# Altium project Adafruit Feather STM32F405 Express.PrjPcb
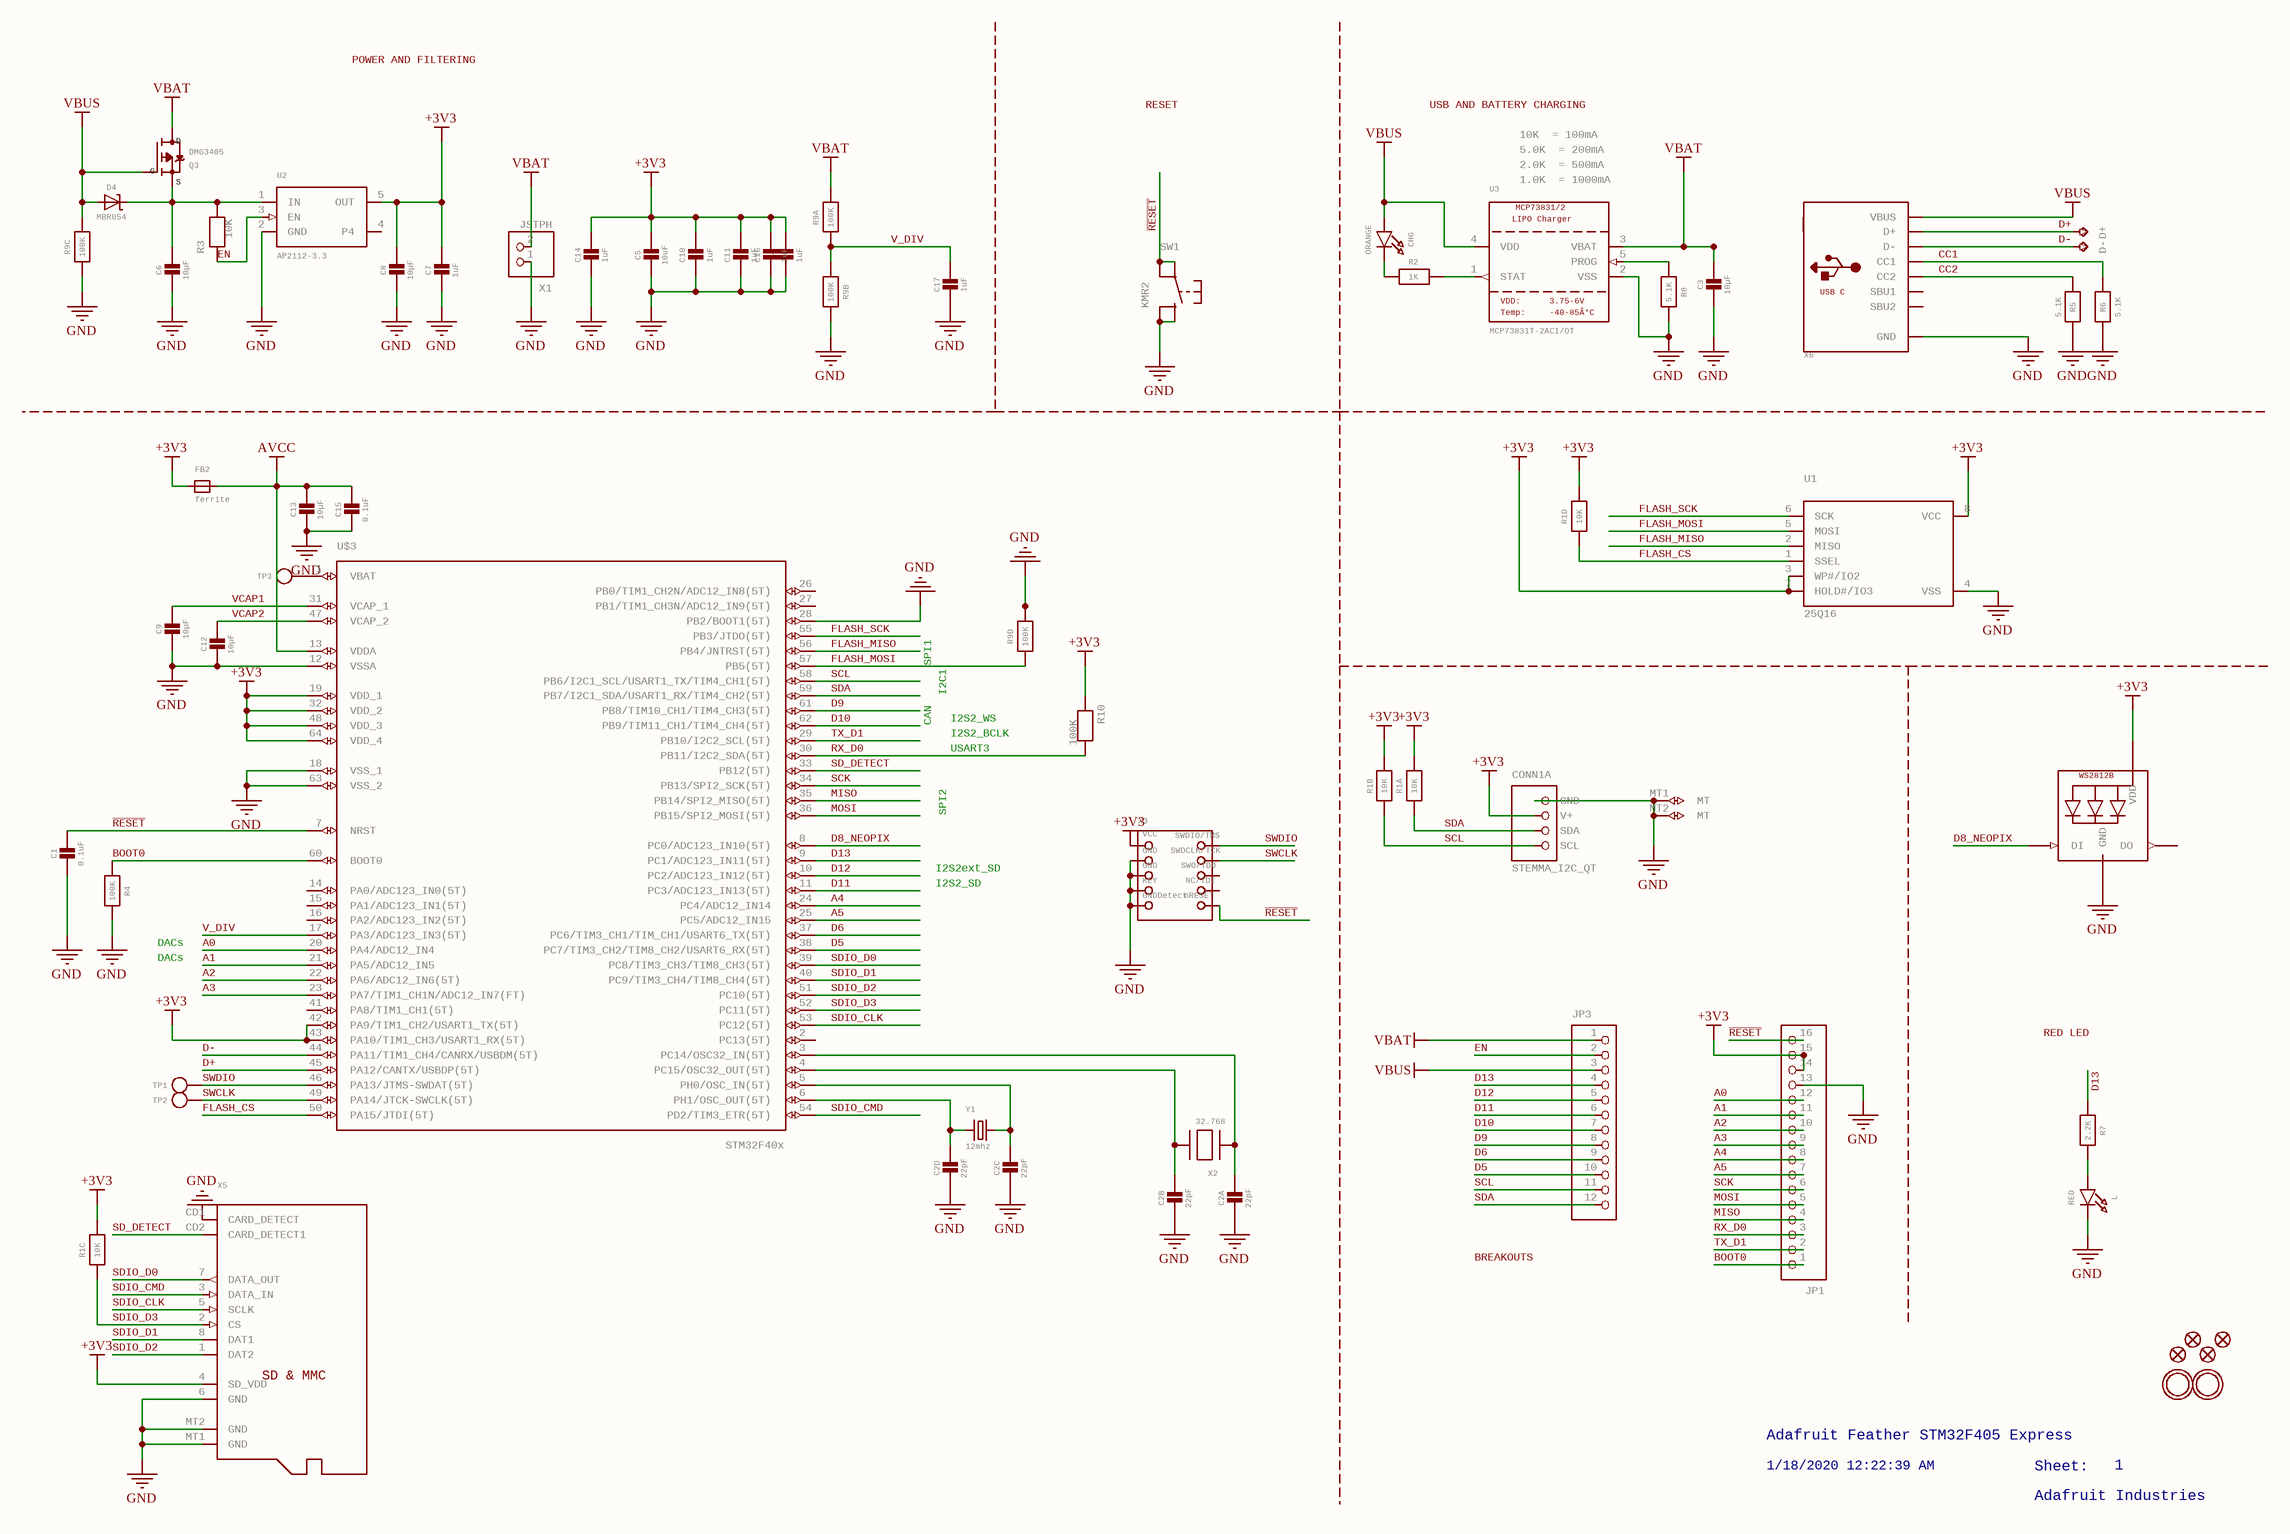
[diagram p0: Adafruit Feather STM32F405 Express.SchDoc]
1 sheet, 58 parts. Net scope: global (net labels, ports and power ports of the same name join across sheets).
Board file: Adafruit Feather STM32F405 Express.PcbDoc

## Sheet Adafruit Feather STM32F405 Express.SchDoc: Adafruit Feather STM32F405 Express
size 409 x 289 mm; COMPANY: ADAFRUIT INDUSTRIES; DRAWN: KTOWN; REV: B; Origin: Eagle; OriginPath: D:\DESK\T_Desk\3D Parts\PCBs\Dual-Node-Performance-Tracker\PCB\Adafruit Feather STM32F405 Express.sch; OriginSheet: 1; Date: 1/18/2020 12:22:39 AM; SheetNumber: 1; GateName_1: G$1; SymbolName_1: FRAME_A3_ADAFRUIT; LibraryName: microbuilder; DeviceSetName: FRAME_A3_ADAFRUIT; Sheet: Sheet:; AdafruitIndustries: Adafruit Industries

### Parts
C1  0.1uF  [0603-NO]
C2  22pF  [RESPACK_4X0603]  (parts A,B,C,D of 4)
C3  10µF  [0805-NO]
C4  1uF  [0603-NO]
C5  10uF  [0805-NO]
C6  10µF  [0805-NO]
C7  1uF  [0603-NO]
C8  10µF  [0805-NO]
C9  10µF  [0805-NO]
C10  1uF  [0603-NO]
C11  1uF  [0603-NO]
C12  10µF  [0805-NO]
C13  10µF  [0805-NO]
C14  1uF  [0603-NO]
C15  0.1uF  [0603-NO]
C16  1uF  [0603-NO]
C17  1uF  [0603-NO]
CHG  ORANGE  [CHIPLED_0805_NOOUTLINE]
CONN1  STEMMA_I2C_QT  [JST_SH4]  (parts A,B,C of 3)
D4  MBR054  [SOD-123]
D+  TPB1,27  [B1,27]  (value not drawn)
D-  TPB1,27  [B1,27]  (value not drawn)
FB2  ferrite  [0805-NO]
JP1  HEADER-1X16ROUND  [1X16_ROUND]  (value not drawn)
JP3  HEADER-1X12  [1X12_ROUND]  (value not drawn)
L  RED  [CHIPLED_0805_NOOUTLINE]
LED1  WS2812B3535  [LED3535]  (value not drawn)
Q3  DMG3405  [SOT23-R]
R1  10K  [RESPACK_4X0603_NO]  (parts A,B,C,D of 4)
R2  1K  [0603-NO]
R3  10K  [0603-NO]
R4  100K  [0603-NO]
R5  5.1K  [0603-NO]
R6  5.1K  [0603-NO]
R7  2.2K  [0603-NO]
R8  5.1K  [0603-NO]
R9  100K  [RESPACK_4X0603_NO]  (parts A,B,C,D of 4)
R10  100K  [0603-NO]
SW1  KMR2  [BTN_KMR2_4.6X2.8]
TP1  TESTPOINTROUND1.5MM  [TESTPOINT_ROUND_1.5MM]  (value not drawn)
TP2  TESTPOINTROUND1.5MM  [TESTPOINT_ROUND_1.5MM]  (value not drawn)
TP3  TESTPOINTROUND1.5MM  [TESTPOINT_ROUND_1.5MM]  (value not drawn)
U1  25Q16  [SOIC8_150MIL]
U2  AP2112-3.3  [SOT23-5]
U3  MCP73831T-2ACI/OT  LIPOCharger: LIPO Charger  Temp: Temp:  VDD: VDD:  [SOT23-5]
U$3  STM32F405R  [TQFP64]  (value not drawn)
U$5  FIDUCIAL_1MM  [FIDUCIAL_1MM]  (value not drawn)
U$31  MOUNTINGHOLE2.5  [MOUNTINGHOLE_2.5_PLATED]  (value not drawn)
U$32  MOUNTINGHOLE2.5  [MOUNTINGHOLE_2.5_PLATED]  (value not drawn)
U$34  FIDUCIAL_1MM  [FIDUCIAL_1MM]  (value not drawn)
U$35  FIDUCIAL_1MM  [FIDUCIAL_1MM]  (value not drawn)
U$37  FIDUCIAL_1MM  [FIDUCIAL_1MM]  (value not drawn)
X1  JSTPH  [JSTPH2]
X2  32.768  [XTAL3215]
X3  JTAG-CORTEX  [2X05_1.27MM_SMT]  (value not drawn)
X5  SD&MMC: SD & MMC  [MICROSD]  (hidden comment: MICROSD)
X6  USBC: USB C  [USB_C_CUSB31-CFM2AX-01-X]  (hidden comment: USB_C)
Y1  12mhz  [CRYSTAL_2.5X2]

### Nets
+3V3: C4.1 C5.1 C7.1 C8.1 C10.1 C11.1 C14.1 C16.1 CONN1.2(V+) FB2.1(P$1) JP1.14 JP1.15 LED1.2(VDD) R1.5 R1.6 R1.7 R1.8 R10.1 U1.3(WP#/IO2) U1.7(HOLD#/IO3) U1.8(VCC) U2.5(OUT) U$3.19(VDD_1) U$3.32(VDD_2) U$3.42(PA9/TIM1_CH2/USART1_TX(5T)) U$3.43(PA10/TIM1_CH3/USART1_RX(5T)) U$3.48(VDD_3) U$3.64(VDD_4) X3.1(VCC) X5.4(SD_VDD)
AVCC: C13.1 C15.1 FB2.2(P$2) U$3.13(VDDA)
GND: C1.2 C2.5 C2.6 C2.7 C2.8 C3.2 C4.2 C5.2 C6.2 C7.2 C8.2 C9.2 C10.2 C11.2 C12.2 C13.2 C14.2 C15.2 C16.2 C17.2 CONN1.1(GND) CONN1.MT1(MT) CONN1.MT2(MT) JP1.13 L.C LED1.4(GND) R4.2 R5.1 R6.1 R8.2 R9.3 R9.5 R9.7 SW1.B(S) SW1.B'(S1) U1.4(VSS) U2.2(GND) U3.2(VSS) U$3.12(VSSA) U$3.18(VSS_1) U$3.28(PB2/BOOT1(5T)) U$3.63(VSS_2) X1.1 X3.3(GND) X3.5(GND) X3.7(KEY) X3.9(GNDDETECT) X5.6(GND) X5.CD1(CARD_DETECT) X5.MT1(GND) X5.MT2(GND) X6.A1B12,B1A12(GND)
VBAT: C3.1 JP3.1 Q3.3(D) R9.8 U3.3(VBAT) X1.2
VBUS: CHG.A D4.A JP3.3 Q3.1(G) R9.6 U3.4(VDD) X6.A4B9,B4A9(VBUS)
A0: JP1.12 U$3.20(PA4/ADC12_IN4)
A1: JP1.11 U$3.21(PA5/ADC12_IN5)
A2: JP1.10 U$3.22(PA6/ADC12_IN6(5T))
A3: JP1.9 U$3.23(PA7/TIM1_CH1N/ADC12_IN7(FT))
A4: JP1.8 U$3.24(PC4/ADC12_IN14)
A5: JP1.7 U$3.25(PC5/ADC12_IN15)
BOOT0: JP1.1 R4.1 U$3.60(BOOT0)
CC1: R6.2 X6.A5(CC1)
CC2: R5.2 X6.B5(CC2)
D5: JP3.10 U$3.38(PC7/TIM3_CH2/TIM8_CH2/USART6_RX(5T))
D6: JP3.9 U$3.37(PC6/TIM3_CH1/TIM_CH1/USART6_TX(5T))
D8_NEOPIX: LED1.1(DI) U$3.8(PC0/ADC123_IN10(5T))
D9: JP3.8 U$3.61(PB8/TIM10_CH1/TIM4_CH3(5T))
D10: JP3.7 U$3.62(PB9/TIM11_CH1/TIM4_CH4(5T))
D11: JP3.6 U$3.11(PC3/ADC123_IN13(5T))
D12: JP3.5 U$3.10(PC2/ADC123_IN12(5T))
D13: JP3.4 R7.1 U$3.9(PC1/ADC123_IN11(5T))
D+: D+.TP U$3.45(PA12/CANTX/USBDP(5T)) X6.A6,B6(D+)
D-: D-.TP U$3.44(PA11/TIM1_CH4/CANRX/USBDM(5T)) X6.A7,B7(D-)
EN: JP3.2 R3.1 U2.3(EN)
FLASH_CS: R1.4 U1.1(SSEL) U$3.50(PA15/JTDI(5T))
FLASH_MISO: U1.2(MISO) U$3.56(PB4/JNTRST(5T))
FLASH_MOSI: R9.4 U1.5(MOSI) U$3.57(PB5(5T))
FLASH_SCK: U1.6(SCK) U$3.55(PB3/JTDO(5T))
MISO: JP1.4 U$3.35(PB14/SPI2_MISO(5T))
MOSI: JP1.5 U$3.36(PB15/SPI2_MOSI(5T))
~{RESET}: C1.1 JP1.16 SW1.A(P) SW1.A'(P1) U$3.7(NRST) X3.10(NRESET)
RX_D0: JP1.3 R10.2 U$3.30(PB11/I2C2_SDA(5T))
SCK: JP1.6 U$3.34(PB13/SPI2_SCK(5T))
SCL: CONN1.4(SCL) JP3.11 R1.2 U$3.58(PB6/I2C1_SCL/USART1_TX/TIM4_CH1(5T))
SD_DETECT: U$3.33(PB12(5T)) X5.CD2(CARD_DETECT1)
SDA: CONN1.3(SDA) JP3.12 R1.1 U$3.59(PB7/I2C1_SDA/USART1_RX/TIM4_CH2(5T))
SDIO_CLK: U$3.53(PC12(5T)) X5.5(SCLK)
SDIO_CMD: U$3.54(PD2/TIM3_ETR(5T)) X5.3(DATA_IN)
SDIO_D0: U$3.39(PC8/TIM3_CH3/TIM8_CH3(5T)) X5.7(DATA_OUT)
SDIO_D1: U$3.40(PC9/TIM3_CH4/TIM8_CH4(5T)) X5.8(DAT1)
SDIO_D2: U$3.51(PC10(5T)) X5.1(DAT2)
SDIO_D3: R1.3 U$3.52(PC11(5T)) X5.2(CS)
SWCLK: TP2.P$1 U$3.49(PA14/JTCK-SWCLK(5T)) X3.4(SWDCLK)
SWDIO: TP1.P$1 U$3.46(PA13/JTMS-SWDAT(5T)) X3.2(SWDIO)
TX_D1: JP1.2 U$3.29(PB10/I2C2_SCL(5T))
V_DIV: C17.1 R9.1 R9.2 U$3.17(PA3/ADC123_IN3(5T))
VCAP1: C9.1 U$3.31(VCAP_1)
VCAP2: C12.1 U$3.47(VCAP_2)
NetC2_1: C2.1 U$3.6(PH1/OSC_OUT(5T)) Y1.1
NetC2_2: C2.2 U$3.5(PH0/OSC_IN(5T)) Y1.3
NetC2_3: C2.3 U$3.4(PC15/OSC32_OUT(5T)) X2.P$2
NetC2_4: C2.4 U$3.3(PC14/OSC32_IN(5T)) X2.P$1
NetC6_1: C6.1 D4.C Q3.2(S) R3.2 U2.1(IN)
NetCHG_C: CHG.C R2.1
NetL_A: L.A R7.2
NetR2_2: R2.2 U3.1(STAT)
NetR8_1: R8.1 U3.5(PROG)
NetTP3_P$1: TP3.P$1 U$3.1(VBAT)

Not connected (* = marked no-connect by the designer): LED1 3(DO); U2 4(P4); U$3 2(PC13(5T)) 14(PA0/ADC123_IN0(5T)) 15(PA1/ADC123_IN1(5T)) 16(PA2/ADC123_IN2(5T)) 26(PB0/TIM1_CH2N/ADC12_IN8(5T)) 27(PB1/TIM1_CH3N/ADC12_IN9(5T)) 41(PA8/TIM1_CH1(5T)); X3 6(SWO) 8(TDI); X6 A8(SBU1) B8(SBU2)

### Notes on the sheet
- POWER AND FILTERING
- RESET
- USB AND BATTERY CHARGING
- 10K  = 100mA
- 5.0K  = 200mA
- 2.0K  = 500mA
- 1.0K  = 1000mA
- SPI1
- I2C1
- CAN
- USART3
- I2S2_WS
- I2S2_BCLK
- SPI2
- I2S2_SD
- I2S2ext_SD
- DACs
- (near R4) DACs
- RED LED
- BREAKOUTS
- Adafruit Feather STM32F405 Express
- 1/18/2020 12:22:39 AM
- Sheet:
- Adafruit Industries
- 1

### Library data of the parts
C1 C4 C7 C10 C11 C14-C17 = CAP_CERAMIC0603_NO: Ceramic Capacitors   For new designs, use the packages preceded by an '_' character since they are more reliable:   The following footprints should be used on most boards: _0402 - Standard footprint for regular board layouts  _0603 - Standard footprint for regular board layouts  _0805 - Standard footprint for regular board layouts  _1206 - Standard footprint for regular board layouts       For extremely tight-pitch boards where space is at a premium, the following 'micro-pitch' footprints can be used (smaller pads, no silkscreen outline, etc.): _0402MP - Micro-pitch footprint for very dense/compact boards  _0603MP - Micro-pitch footprint for very dense/compact boards  _0805MP - Micro-pitch footprint for very dense/compact boards  _1206MP - Micro-pitch footprint for very dense/compact boards; GateName_1: G$1; SymbolName_1: CAPACITOR; DeviceName: 0603_NO; LibraryName: microbuilder; DeviceSetName: CAP_CERAMIC
C2 = CAP_4PACK1206: GateName_1: 4; SymbolName_1: CAPACITOR; GateName_2: 3; GateName_3: 2; GateName_4: 1; DeviceName: 1206; SymbolName_2: CAPACITOR; SymbolName_3: CAPACITOR; SymbolName_4: CAPACITOR; LibraryName: microbuilder; DeviceSetName: CAP_4PACK
C3 C5 C6 C8 C9 C12 C13 = CAP_CERAMIC0805-NOOUTLINE: Ceramic Capacitors   For new designs, use the packages preceded by an '_' character since they are more reliable:   The following footprints should be used on most boards: _0402 - Standard footprint for regular board layouts  _0603 - Standard footprint for regular board layouts  _0805 - Standard footprint for regular board layouts  _1206 - Standard footprint for regular board layouts       For extremely tight-pitch boards where space is at a premium, the following 'micro-pitch' footprints can be used (smaller pads, no silkscreen outline, etc.): _0402MP - Micro-pitch footprint for very dense/compact boards  _0603MP - Micro-pitch footprint for very dense/compact boards  _0805MP - Micro-pitch footprint for very dense/compact boards  _1206MP - Micro-pitch footprint for very dense/compact boards; GateName_1: G$1; SymbolName_1: CAPACITOR; DeviceName: 0805-NOOUTLINE; LibraryName: microbuilder; DeviceSetName: CAP_CERAMIC
  C8: REV: B
CHG L = LED0805_NOOUTLINE: LED0603 - 0603 Surface Mount Package    2mA: Green LED - Low Power (3.9mcd, 2ma, 1.7Vf) - Digikey: 475-2709-2-ND  Orange LED - Low Power (9.8mcd, 2ma, 1.8Vf) - Digikey: 475-1194-2-ND  Red LED - Low Power (5mcd, 2ma, 1.8Vf) - Digikey: 475-1195-2-ND  Yellow LED - Low Power (7mcd, 2ma, 1.8Vf) - Digikey: 475-1196-2-ND       5mA: Blue LED - Low Power (17mcd, 5ma, 2.9Vf) - Digikey: LNJ937W8CRACT-ND    0805 - 0805 Surface Mount Package    2mA: Red LED (8.8mcd, 2mA, 1.8Vf, Clear) - Low Power [Digikey: 475-2510-1-ND]  Green LED (5mcd, 2mA, 1.8Vf, Clear) - Low Power [Digikey: 475-2730-1-ND]  Yellow LED (11.3mcd, 2mA, 1.8Vf, Clear) - Low Power [Digikey: 475-2555-1-ND]       20mA: Red LED (104mcd, 20mA, Diffused) - LS R976 [Digikey: 475-1278-6-ND]  Red LED (12mcd, 20mA, 2.0Vf, Clear) - APT2012EC [Digikey: 754-1128-1-ND]  Green LED (15mcd, 20mA, 2.2Vf, Clear) - APT2012GC [Digikey: 754-1131-1-ND]  Orange LED (160mcd, 20mA, 2.1Vf, Clear) - APT2012SECK [Digikey: 754-1130-1-ND]     1206 - 1206 Surface Mount Package  Green LED (26mcd, 20mA, Diffused) - LG N971  [Digikey: 475-1407-6-ND]  Red LED (15mcd, 20mA, Diffused) - LH N974 [Digikey: 475-1416-6-ND]     Cree - Cree High-Power Surface Mount LEDs  XPEBWT-L1-0000-00D50 - White 111lm 350mA 2.9Vf 6200K 110Â°  XTEAWT-00-0000-00000LEE3 - White 114lm 350mA 2.85Vf 5000K 115Â°     Everlight - Everlight 45-21 Series Surface Mount LEDs  45-21/QK2C-B2832AC2CB2/2T - Warm White 2000mcd 20mA 3.25Vf 3050K 120Â°  45-21/LK2C-B38452C4CB2/2T - Nuetral White 2000mcd 20mA 3.25Vf 4150K 120Â°  45-21/LK2C-B50634C6CB2/2T - Cold White 2200mcd 20mA 3.25Vf 5650K 120Â°     PLCC2 Reverse Mount LS T77K-J1L2-1-0-2-R18-Z - Red 11.25mcd 2mA 1.8Vf 630nm 120Â°  LO T77K-L1M2-24-Z - Orange 19.6mcd 2mA 1.8Vf 606nm 120Â°  LY T77K-K2M1-26-Z - Yellow 15.7mcd 2mA 1.8Vf 587nm 120Â°; GateName_1: G$1; SymbolName_1: LED; DeviceName: 0805_NOOUTLINE; LibraryName: microbuilder; DeviceSetName: LED
CONN1 = STEMMA_I2C_QT: GateName_1: G$1; GateName_2: G$2; SymbolName_2: MOUNTING; GateName_3: G$3; DeviceName: _QT; SymbolName_1: STEMMA_I2C; SymbolName_3: MOUNTING; LibraryName: microbuilder; DeviceSetName: STEMMA_I2C
D4 = DIODE-SCHOTTKYSOD-123: GateName_1: G$1; SymbolName_1: DIODE-SCHOTTKY; DeviceName: SOD-123; LibraryName: microbuilder; DeviceSetName: DIODE-SCHOTTKY
D+ D- = TPB1,27: Test pad; GateName_1: G$1; SymbolName_1: TP; POPULARITY: 19; DeviceName: B1,27; LibraryName: testpad; DeviceSetName: TP
FB2 = FERRITE-0805NO: Ferrite Bead   0603 MMZ1608B121C - 120 Ohm @ 100MHz, 600mA, 0.15 Ohm DC Resistance - Digikey: 445-2164-1-ND  BK1608HW121-T - 120 Ohm, 600mA Ferrite Chip - Digikey: 587-1876-2-ND       0805 HZ0805B272R-10 - 2.7K Ohm @ 100MHz, 200mA, 0.8 Ohm DC Resistance - Digikey: 240-2504-1-ND (see also Murata BLM21BD272SN1L)  MMZ2012Y152B - 1.5K Ohm @ 100MHz, 500mA, 0.4 Ohm DC Resistance - Digikey: 445-1560-1-ND - Mainly for high frequency (80-400MHz)  MMZ2012R102A - 1K Ohm @ 100MHz, 500mA, 0.3 Ohm DC Resistance - Digikey: 445-1555-2-ND - More general purpose (10-200MHz); GateName_1: G$1; SymbolName_1: FERRITE; DeviceName: -0805NO; LibraryName: microbuilder; DeviceSetName: FERRITE
JP1 = HEADER-1X16ROUND: PIN HEADER; GateName_1: A; SymbolName_1: PINHD16; DeviceName: ROUND; LibraryName: microbuilder; DeviceSetName: HEADER-1X16
JP3 = HEADER-1X12: GateName_1: G$1; SymbolName_1: PINHD12; LibraryName: microbuilder; DeviceSetName: HEADER-1X12
LED1 = WS2812B3535: GateName_1: G$1; SymbolName_1: WS2812BLED; DeviceName: 3535; LibraryName: microbuilder; DeviceSetName: WS2812B; WS2812B: WS2812B
Q3 = MOSFET-P: P-Channel Mosfet   LEGEND   VDS: Voltage Drain-Source ID: Drain Current RDS(ON): Drain-Source On-State Resistance VGS(TH): Gate-Source Threshold Voltage CISS: Drain-Source Input Capacitance    SOT-23   Name	VDS	ID	RDS(ON)	VGS(TH)	CISS	Order Number	   IRLML5103	30V	760mA	600 mOhm	--	75pF @ 25V	Digikey: IRLML5103PBFCT-ND	   IRLML6401	12V	4.3A	50 mOhm	950mV @ 250ÂµA	830pF @ 10V	Digikey: IRLML6401PBFTR-ND	   NTR0202PL	20V	400mA	800 mOhm	2.3V @ 250uA	70pF @ 5V	Digikey: NTR0202PLT1GOSTR-ND	   NTR4101PT1G	20V	1.8A	85 mOhm	1.2V @ 250uA	675pF @ 10V	Digikey: NTR4101PT1GOSCT-ND	   DMP2004K	20V	600mA	900 mOhm	1V @ 250uA	175pF @ 16V	Digikey: DMP2004KDICT-ND	   PMV65XP	20V	3.9A	76 mOhm	950mV @ 1mA	725pF @ 20V	Digikey: 568-2358-2-ND	   							   							TO-252   Name	VDS	ID	RDS(ON)	VGS(TH)	CISS	Order Number	   AOD417	30V	25A	34 mOhm	3V @ 250ÂµA	920pF @ 15V	Digikey: 785-1106-2-ND	PowerPak   Name	VDS	ID	RDS(ON)	VGS(TH)	CISS	Order Number	   AON7401	30V	12A	14 mOhm	3V @ 250ÂµA	2600pF @ 15V	Digikey: 785-1302-1-ND; GateName_1: G$1; SymbolName_1: MOSFET-P; LibraryName: microbuilder; DeviceSetName: MOSFET-P; D: D; S: S; G: G
R1 R9 = RESISTOR_4PACK_NO: Resistor Packs (4 resistors)   4 x 0603 10K 1/16W - Digikey: YC164J-10KCT-ND; GateName_1: G$1; GateName_2: G$2; GateName_3: G$3; GateName_4: G$4; DeviceName: _NO; SymbolName_1: RESISTOR; SymbolName_2: RESISTOR; SymbolName_3: RESISTOR; SymbolName_4: RESISTOR; LibraryName: microbuilder; DeviceSetName: RESISTOR_4PACK
R2-R8 R10 = RESISTOR_0603_NOOUT: Resistors   For new designs, use the packages preceded by an '_' character since they are more reliable:   The following footprints should be used on most boards: _0402 - Standard footprint for regular board layouts  _0603 - Standard footprint for regular board layouts  _0805 - Standard footprint for regular board layouts  _1206 - Standard footprint for regular board layouts       For extremely tight-pitch boards where space is at a premium, the following 'micro-pitch' footprints can be used (smaller pads, no silkscreen outline, etc.): _0402MP - Micro-pitch footprint for very dense/compact boards  _0603MP - Micro-pitch footprint for very dense/compact boards  _0805MP - Micro-pitch footprint for very dense/compact boards  _1206MP - Micro-pitch footprint for very dense/compact boards; GateName_1: G$1; SymbolName_1: RESISTOR; DeviceName: _0603_NOOUT; LibraryName: microbuilder; DeviceSetName: RESISTOR
SW1 = SWITCH_TACT_SMT4.6X2.8: SMT Tact Switches 6x6mm - Digikey: P12940SCT-ND  KMR2 (4.6x2.8mm) - Digikey: 401-1426-1-ND  EVQ-PQHB55 - Light Touch, 160GF (4.5x4.5mm) - Digikey: P8090SCT-ND  KMT0 - KMT021 NGJ LHS (etc.) IP68/Waterproof - Digikey: CKN10289CT-ND; GateName_1: G$1; SymbolName_1: BUTTON_4PIN; DeviceName: 4.6X2.8; LibraryName: microbuilder; DeviceSetName: SWITCH_TACT_SMT
TP1-TP3 = TESTPOINTROUND1.5MM: Test Point   Various test points for characterisation and PCB testing    TESTPOINT_SMT - Compact Surface Mount Test Point [Digikey: 5016KTR-ND]; GateName_1: G$1; SymbolName_1: TESTPOINT; DeviceName: ROUND1.5MM; LibraryName: microbuilder; DeviceSetName: TESTPOINT
U1 = SPIFLASH_8PIN: SOIC8 SPI Flash   Be careful with the size since SOIC8 flash comes in several 'widths'   SOIC8 150 mil M25P16 - 16Mbit (2Mbit x 8) Serial Flash (75MHz SPI Bus), Supply: 2.7-3.6V  Digikey:  SOIC8 - M25P16-VMN6P-ND       SOIC8 208 mil W25Q16BVSSIG - 16Mbit (2Mbit x 8) Serial Flash (104MHz SPI Bus), Supply: 2.7-3.6V  Digikey:  SOIC8 - W25Q16BVSSIG-ND; GateName_1: G$1; SymbolName_1: M25P16; LibraryName: microbuilder; DeviceSetName: SPIFLASH_8PIN
U2 = VREG_SOT23-5: SOT23-5 Fixed Voltage Regulators      Part	Current Out	V Out	V In	V Dropout	Î¸JA (Â°C/W)	TJ (Â°C)	Digikey Part No.	     ADP121	  150mA	  3.3V	  3.4-5.5V	  0.09V @ 150mA	  --	  --	  ADP121-AUJZ33R7CT-ND	     ADP121	  150mA	  3.0V	  3.1-5.5V	  0.09V @ 150mA	  --	  --	  ADP121-AUJZ30R7CT-ND	     ADP122	  300mA	  3.3V	  3.4-5.5V	  0.085V @ 300mA	  --	  --	  ADP122AUJZ-3.3-R7CT-ND	     ADP1712	  300mA	  3.3V	  3.5-5.5V	  0.17V @ 300mA	  --	  --	  ADP1712AUJZ-3.3-R7TR-ND	     AP7311 (Low Cost)	  150mA	  3.3V	  3.5-6V	  0.15V @ 150mA	  --	  --	  AP7311-33WG-7DICT-ND	     LD39015M18R	  150mA	  1.8V	  1.9V-5.5V	  0.08V @ 100mA	  --	  --	  497-6977-1-ND	     LP2985A-33DBVR	  150mA	  3.3V	  3.3-16V	  0.28V @ 150mA	  206	  150	  296-18479-1-ND	     MCP1824T-3302E/OT	  300mA	  3.3V	  3.5V-6V	  0.2V @ 300mA	  --	  --	  MCP1824T-3302E/OTCT-ND	     MIC5205-2.5YM5 TR	  150mA	  2.5V	  2.7-16V	  0.165V @ 150mA	  --	  --	  576-1257-2-ND	     MIC5205-3.0YM5 TR	  150mA	  3.0V	  3.2V-16V	  0.165V @ 150mA	  --	  --	  576-1258-2-ND	     MIC5205-3.3YM5 TR	  150mA	  3.3V	  3.5V-16V	  0.165V @ 150mA	  --	  --	  576-1259-2-ND	     TPS780330220	  150mA	  3.3V+2.2V	  3.6-5.5V	  250mV Max	  --	  --	  296-23332-1-ND	     TDA3663/N1,135	  100mA	  3.3V	  3.5-45V	  0.18V @ 50mA	  --	  --	  568-5343-1-ND	     	  	  	  	  	  	  	  	     	  	  	  	  	  	  	  	   Max operating temp can be calculated using Î¸JA, TJ (max junction temperature), and power in watts.  Set the "Maximum Ambient Temperature" until it reaches TJ ("Max Junction Temperature"), which is the absolute limit for safe use of the regulator: Heat Sink Temperature Calculator   For example, With 12V source into a 3.3V LP2985 and a 30mA load, we are dissipating (12V-3.3V) * 0.03A = 0.261W.  With a Î¸JA of 206 Â°C/W, a TJ of 150Â°C, and 261mW we can safely use the chip without a heat sink up to 75Â°C (=147.1Â°C Junction Temperature).; GateName_1: G$1; SymbolName_1: VREG_SOT23-5; LibraryName: microbuilder; DeviceSetName: VREG_SOT23-5
U3 = MCP73831/2: MCP73831/2 LIPO Charger    VDD: 3.75 - 6V  Temp -40 - 85Â°C  Programmable Charge Rate: 15-500mA       NOTE: STAT is a tri-state logic output on the MCP73831 and an open-drain output on the MCP73832.   SOT23-5 with 4.2V output and tri-state logic on STAT = MCP73831T-2ACI/OT; GateName_1: G$1; SymbolName_1: MCP73831/2; LibraryName: microbuilder; DeviceSetName: MCP73831/2; MCP73831/2: MCP73831/2; -40-85Â°C: -40-85Â°C; 3.75-6V: 3.75-6V
U$3 = STM32F405R: STM32F405 64 pin LQFP  reviewed: YES tested: YES; GateName_1: G$1; SymbolName_1: COMPLETE_64_F4XX; LibraryName: adafruit_micro; DeviceSetName: STM32F405R; STM32F40x: STM32F40x
U$5 U$34 U$35 U$37 = FIDUCIAL_1MM: Fiducial Alignment Points   Various fiducial points for machine vision alignment.; GateName_1: G$1; DeviceName: _1MM; BOM: EXCLUDE; SymbolName_1: FIDUCIAL; LibraryName: microbuilder; DeviceSetName: FIDUCIAL
U$31 U$32 = MOUNTINGHOLE2.5: Mounting Hole   For #2 screws (0.086"/2.18mm width, 0.094"/2.4mm hole) use 2.5mm; GateName_1: G$1; DeviceName: 2.5; BOM: EXCLUDE; SymbolName_1: MOUNTINGHOLE; LibraryName: microbuilder; DeviceSetName: MOUNTINGHOLE
X1 = CON_JST_PH_2PIN: JST 2-Pin Right-Angle Connector  PH-Series - 4UConnector: 17311  SH-Series - 4UConnector: 07278; GateName_1: G$1; SymbolName_1: PINHD2; LibraryName: microbuilder; DeviceSetName: CON_JST_PH_2PIN
X2 = XTAL-3.2X1.5: Low cost SMT crystals, no capacitors included    http://www.ladyada.net/library/eagle; GateName_1: G$1; SymbolName_1: XTAL; DeviceName: -3.2X1.5; LibraryName: adafruit2; DeviceSetName: XTAL
X3 = JTAG-CORTEX: Serial Wire (SW-DP) Connector   Standard 0.05" 10-pin connector is for use with the Cortex M and Cortex A SWD (serial wire debugger) interface (SW-DP)Connectors 2x05_1.27MM_SMT - Inexpensive surface-mount header with bare pins, compatible with standard 10-pin SWD cables (4UCON: 16846)  2x05_1.27MM_BOX_NOPOSTS - Polarised surface-mount box (4UCON with caps: 19735, without caps: 15117  2x05_1.27MM_BOX_POSTS - Polarised surface-mount box with mounting holes (4UCON: 20317)    Pinout: http://infocenter.arm.com/help/topic/com.arm.doc.faqs/attached/13634/cortex_debug_connectors.pdf  http://www.keil.com/peripherals/coresight/connectors.asp; GateName_1: G$1; SymbolName_1: JTAG-CORTEX; LibraryName: microbuilder; DeviceSetName: JTAG-CORTEX; nRESET: nRESET; NC/TDI: NC/TDI; SWO/TDO: SWO/TDO; SWDCLK/TCK: SWDCLK/TCK; SWDIO/TMS: SWDIO/TMS; VCC: VCC; GND: GND; KEY: KEY; GNDDetect: GNDDetect
X5 = MICROSD: MicroSD/Transflash Card Holder with SPI pinout   3M: 2908-05WB-MG 4UConnector: 19656   Footprint courtesy: Adafruit Industries; GateName_1: G$1; SymbolName_1: TRANSFLASH; LibraryName: microbuilder; DeviceSetName: MICROSD
X6 = USB_C: USB Type-C USB 2.0 Connector; GateName_1: G$1; SymbolName_1: USB_C; LibraryName: microbuilder; DeviceSetName: USB_C
Y1 = CRYSTAL2.5X2.0: Crystals   HC49UP - Surface Mount Crystal  4.0MHz 18pF +/-30ppm Surface Mount Crystal [Digikey: 535-9857-1-ND]  12.0 MHz Surface Mount Crystal [Digikey: 535-9869-6-ND]  25.0 MHz Surface Mount Crystal [Digikey: 535-9078-1-ND]       2.5 x 2.0mm - MEMs SMT Crystal  16.0 MHz 10pF 20ppm 2.5 x 2.0mm Crystal [Digikey -40-85Â°C: 535-10923-1-ND]       3.2 x 2.5mm - MEMs SMT Crystal  12.0 MHz 8pF 15ppm 3.2 x 2.5mm Crystal [Digikey: -10-70Â°C: 644-1047-1-ND -40-125Â°C: 644-1128-1-ND] 40~85Â°C cheaper: 644-1173-6-ND  16.0 MHz 8pF 15ppm 3.2 x 2.5mm Crystal [Digikey: -10-70Â°C: 644-1049-1-ND -40-125Â°C: 644-1129-2-ND]-40~85Â°C cheaper: 644-1175-6-ND  16.0 MHz 10pF 10ppm 3.2 x 2.5mm Crystal [Digikey: 644-1100-1-ND]  27.12 MHz 18pF 30ppm 3.2 x 2.5mm Crystal [Digikey: 887-1424-1-ND]  27.12MHz 10pF 10ppm 3.2 x 2.5mm Crystal [Digikey: 887-1329-1-ND]       4.9 x 1.8mm - MEMs SMT Crystal  32.768 KHz 12.5pF 20ppm 4.9 x 1.8mm Crystal [Digikey: SE2415CT-ND]       8.0 x 3.8mm - Surface Mount Crystal  32.768kHz 12.5pF 20ppm -40Â°C-85Â°C [Digikey: 535-9166-2-ND]       Cylinder 32.768KHz Cylinder Crystal (2x6mm body) [Ex. Digikey: 300-8341-2-ND]; GateName_1: G$1; SymbolName_1: CRYSTAL; DeviceName: 2.5X2.0; LibraryName: microbuilder; DeviceSetName: CRYSTAL